# Altium schematic sheet PCM5102.SchDoc
size A4; SheetNumber: 1; SheetTotal: 4
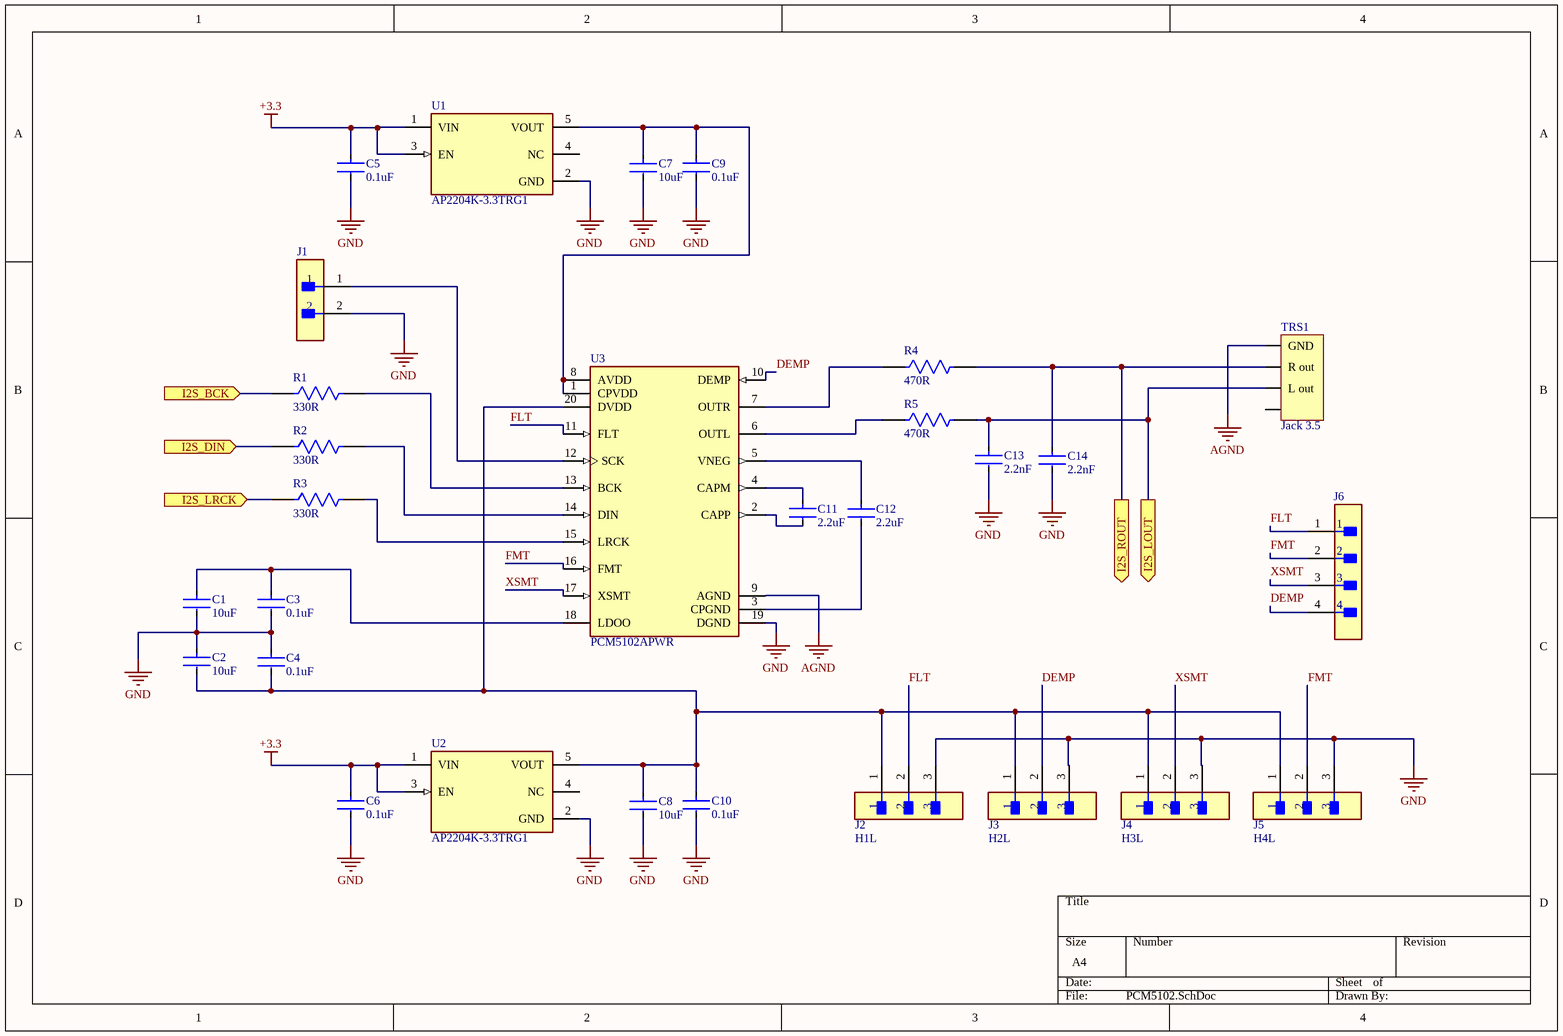
[diagram p0: PCM5102.SchDoc]

## Parts
C1  10uF  [FP-CL21-IPC_C]
C2  10uF  [FP-CL21-IPC_C]
C3  0.1uF  [FP-CL21-IPC_C]
C4  0.1uF  [FP-CL21-IPC_C]
C5  0.1uF  [FP-CL21-IPC_C]
C6  0.1uF  [FP-CL21-IPC_C]
C7  10uF  [FP-CL21-IPC_C]
C8  10uF  [FP-CL21-IPC_C]
C9  0.1uF  [FP-CL21-IPC_C]
C10  0.1uF  [FP-CL21-IPC_C]
C11  2.2uF  [FP-CL21-IPC_C]
C12  2.2uF  [FP-CL21-IPC_C]
C13  2.2nF  [FP-CL21-IPC_C]
C14  2.2nF  [FP-CL21-IPC_C]
J1  M22-2510205  [FP-M22-2510205-MFG]  (value not drawn)
J2  H1L  [FP-951103-8622-AR-MFG]
J3  H2L  [FP-951103-8622-AR-MFG]
J4  H3L  [FP-951103-8622-AR-MFG]
J5  H4L  [FP-951103-8622-AR-MFG]
J6  M20-9990445  [FP-M20-9990445-MFG]  (value not drawn)
R1  330R  [FP-RP732A-IPC_C]
R2  330R  [FP-RP732A-IPC_C]
R3  330R  [FP-RP732A-IPC_C]
R4  470R  [FP-RP732A-IPC_C]
R5  470R  [FP-RP732A-IPC_C]
TRS1  Jack 3.5  [PJ-327A]
U1  AP2204K-3.3TRG1  [FP-SOT25-IPC_C]
U2  AP2204K-3.3TRG1  [FP-SOT25-IPC_C]
U3  PCM5102APWR  [FP-PW0020A-IPC_A]

## Ports
I2S_BCK (in, see ESP32S3[2A]), I2S_DIN (in, see ESP32S3[2A]), I2S_LOUT (out, see TPA3116D2[1C]), I2S_LRCK (in, see ESP32S3[2A]), I2S_ROUT (out, see TPA3116D2[1B])

## Nets
+3.3: C5.1 C6.1 U1.1(VIN) U1.3(EN) U2.1(VIN) U2.3(EN)
AGND: TRS1.1(GND) U3.9(AGND)
GND: C1.2 C2.1 C3.2 C4.1 C5.2 C6.2 C7.2 C8.2 C9.2 C10.2 C13.2 C14.2 J1.2 J2.3 J3.3 J4.3 J5.3 U1.2(GND) U2.2(GND) U3.19(DGND)
DEMP: J3.2 J6.4 U3.10(DEMP)
FLT: J2.2 J6.1 U3.11(FLT)
FMT: J5.2 J6.2 U3.16(FMT)
I2S_BCK: R1.1 ; port I2S_BCK
I2S_DIN: R2.1 ; port I2S_DIN
I2S_LOUT: C13.1 R5.2 TRS1.3(L_out) ; port I2S_LOUT
I2S_LRCK: R3.1 ; port I2S_LRCK
I2S_ROUT: C14.1 R4.2 TRS1.2(R_out) ; port I2S_ROUT
XSMT: J4.2 J6.3 U3.17(XSMT)
NetC1_1: C1.1 C3.1 U3.18(LDOO)
NetC2_2: C2.2 C4.2 C8.1 C10.1 J2.1 J3.1 J4.1 J5.1 U2.5(VOUT) U3.20(DVDD)
NetC7_1: C7.1 C9.1 U1.5(VOUT) U3.1(CPVDD) U3.8(AVDD)
NetC11_1: C11.1 U3.4(CAPM)
NetC11_2: C11.2 U3.2(CAPP)
NetC12_1: C12.1 U3.5(VNEG)
NetC12_2: C12.2 U3.3(CPGND)
NetJ1_1: J1.1 U3.12(SCK)
NetR1_2: R1.2 U3.13(BCK)
NetR2_2: R2.2 U3.14(DIN)
NetR3_2: R3.2 U3.15(LRCK)
NetR4_1: R4.1 U3.7(OUTR)
NetR5_1: R5.1 U3.6(OUTL)

Not connected (* = marked no-connect by the designer): TRS1 4; U1 4(NC); U2 4(NC)

## Library data of the parts
C1-C14 = CMP-13271-002689-1: CL21 Series 0805 47nF 50V ±5% Tolerance X7R Multilayer Ceramic Chip Capacitor; Voltage Rating (DC): 50V; Package Quantity: 10000; Height: 0.85mm; Max Operating Temperature: 125°C; Dielectric: X7R; Radiation Hardening: No; Mount: Surface Mount; Voltage Rating: 50V; Tolerance: 5%; Depth: 1.25mm; Min Operating Temperature: -55°C; Width: 0.049inch; Case/Package: 0805; Length: 2mm; Packaging: Tape and Reel; Thickness: 0.037inch
  C1 C2 C7 C8: Capacitance: 10uF
  C3-C6 C9 C10: Capacitance: 0.1uF
  C11 C12: Capacitance: 2.2uF
  C13 C14: Capacitance: 2.2nF
J1 = CMP-15831-000005-1: CONN HEADER VERT 2POS 2MM; Manufacturer: Harwin; Conn Gender: Male; Current Rating: 2A; Number Of Contacts: 2; Conn Orientation: Vertical; Temperature Range Low: -40°C; Device Class L1: Connectors; ComponentLink2URL: https://cdn.harwin.com/pdfs/C018XX_M22_Series_Connectors.pdf; Temperature Range High: +105°C; Pitch: 2mm; Number Of Rows: 1; Temperature: -40°C to +105°C; Automotive: No; Device Class L3: unset; Octopart: https://octopart.com/m22-2510205-harwin-2538221; Mouser Description: Headers & Wire Housings 2 PIN SIL VERTICAL GOLD PIN HEADER; Height: 5.45mm; Category: Conn; Digikey Description: CONN HEADER VERT 2POS 2MM; Contact Material: Gold,Nickel; Lead Free: Yes; ComponentLink2Description: Datasheet; Manufacturer Part Number: M22-2510205; Device Class L2: Headers and Wire Housings; Package: 0; Footprint Url: https://cdn.harwin.com/pdfs/M22-251.pdf; RoHS: TRUE
J2-J5 = CMP-05379-000003-1: CONN HEADER VERT 3POS 2MM; Manufacturer Part Number: 951103-8622-AR; Manufacturer: 3M; Conn Gender: Male; Current Rating: 2A; Number Of Contacts: 3; Conn Orientation: Straight; Digikey Description: CONN HEADER VERT 3POS 2MM; Device Class L3: unset; Category: Conn; Height: 6.3mm; RoHS: TRUE; Contact Material: Gold,Nickel; ComponentLink2Description: Datasheet; Temperature Range Low: -55°C; Device Class L1: Connectors; Pitch: 2mm; Mouser Description: Header; PinStrip; CopperAlloy; HighTempThermoplastic; 3Cnts; 1A; RtAngle; 951Series; Octopart: https://octopart.com/951103-8622-ar-3m-14400669; Package: 951103-8622-AR; Lead Free: Yes; Device Class L2: Headers and Wire Housings; Temperature Range High: +125°C; ComponentLink2URL: http://multimedia.3m.com/mws/media/1400506O/3m-pin-strip-header-951-series-78-5100-2653-3.pdf; Automotive: No; Temperature: -55°C to +125°C; Number Of Rows: 1
J6 = CMP-00671-05399696-1: M20-9990445 Conn Unshrouded Header HDR 4 POS 2.54mm Solder ST Thru-Hole Bulk/Loose; Insulation Resistance: 10GΩ; Connector Type: Male Pin; Voltage Rating (DC): 750V; Max Current Rating: 3A; Contact Resistance: 25mΩ; Number of Contacts: 4; Gender: Male; Color: Black; Height: 2.54mm; Contact Material: Brass, Bronze, Gold, Nickel; Orientation: Straight; Width: 12.7mm; Mount: Through Hole; Pitch: 2.54mm; Lead Pitch: 2.54mm; RoHS: Compliant; Max Operating Temperature: 105°C; Case/Package: SIL; NexarPartId: 5399696; Depth: 2.54mm; Length: 10.16mm; Current Rating: 3A; Contact Plating: Gold; Radiation Hardening: No; Contact Mating Length: 6.096mm; Voltage Rating (AC): 750V; Termination: Solder; REACH SVHC: No SVHC; Weight: 45.359237g; Number of Rows: 1; Min Operating Temperature: -40°C; Housing Material: Nylon; Housing Color: Black; Number of Positions: 4; Number of Pins: 4
R1-R5 = CMP-03211-008429-2: Surface Mount Resistors, Precision Resistor, 2 Terminations, Size Code 0805, Cut Tape Length, .1%, Thin Film, 10K 0.1% 10PPM; Temperature Coefficient: 15ppm/°C; Number of Resistors: 1; Power Rating: 125mW; Voltage Rating (DC): 150V; REACH SVHC: No SVHC; Height: 0.55mm; Number of Pins: 2; ELV: Compliant; Termination: Solder; Number of Terminations: 2; Case Code (Imperial): 0805; Mount: Surface Mount; Case/Package: 0805; Case Code (Metric): 2012; Length: 2mm; Packaging: Cut Tape; Composition: Thin Film; Max Operating Temperature: 155°C; Tolerance: 0.1%; Min Operating Temperature: -55°C; Package Quantity: 250; Width: 1.25mm; Voltage Rating: 150V; Weight: 0.000194oz
  R1-R3: Resistance: 330R
  R4 R5: Resistance: 470R
TRS1 = PJ327A
U1 U2 = CMP-2000-05782-2: IC REG LINEAR 3.3V 150MA SOT23-5; Max Input Voltage: 24V; Min Input Voltage: 2.3V; Quiescent Current: 50uA; Number of Regulators: 1; Max Output Current: 250mA; Reference Voltage: 1.24V; Output Type: Fixed; Polarity: Positive; Dropout Voltage: 360mV; Weight: 0.001058oz; Min Operating Temperature: -40°C; Output Current: 150mA; Lead Free: Lead Free; Length: 3.02mm; Height: 1.3mm; Width: 1.7mm; Case/Package: SOT-23-5; Max Operating Temperature: 85°C; Package Quantity: 3000; Mount: Surface Mount; Output Voltage: 3.3V; Number of Pins: 5; Packaging: Tape and Reel; Number of Outputs: 1
U3 = CMP-04861-000013-1: IC DAC 16/24/32BIT 384K 20TSSOP; Power Consumption: 59.4mW; Number of Analog Inputs: 0; Supply Type: Analog; Resolution: 32b; Number of Analog Outputs: 2; Max Power Dissipation: 187mW; Sampling Rate: 384KS/s; Operating Supply Voltage: 3.3V; Number of Bits: 32; Max Supply Voltage: 3.6V; Interface: Serial; Polarity: Unipolar; Min Supply Voltage: 3V; Output Type: Voltage; Signal to Noise Ratio (SNR): 112dB; Contact Plating: Gold; Package Quantity: 2000; Number of Pins: 20; Max Operating Temperature: 85°C; Series: DirectPath™; Case/Package: TSSOP; Conversion Rate: 384KS/s; Number of DAC Channels: 2; Mount: Surface Mount; REACH SVHC: No SVHC; Packaging: Tape and Reel; Number of Converters: 2; Min Operating Temperature: -25°C; Lead Free: Lead Free